# Altium project can_gateway_v3s_hardwave.PrjPcb
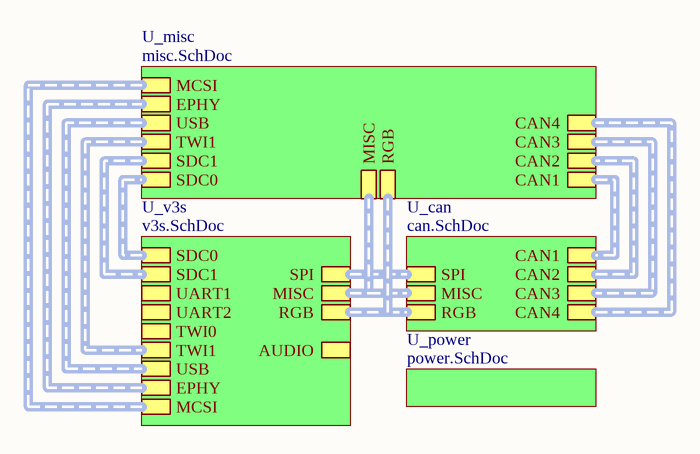
[diagram p0: can_gateway_v3s_hardwave.SchDoc]
5 sheets, 219 parts. Net scope: hierarchical (ports join the sheet entries above them; power ports are global).
Board file: can_gateway_v3s_hardwave.PcbDoc
Sheets:
  can_gateway_v3s_hardwave.SchDoc
    U_v3s = v3s.SchDoc
    U_power = power.SchDoc
    U_can = can.SchDoc
    U_misc = misc.SchDoc

## Sheet can_gateway_v3s_hardwave.SchDoc
size A4

### Sub-sheets
U_can = can.SchDoc: SPI (harness SPI), MISC (harness MISC), RGB (harness RGB), CAN4 (harness CAN), CAN3 (harness CAN), CAN2 (harness CAN), CAN1 (harness CAN)
U_misc = misc.SchDoc: SDC0 (harness SDC), CAN4 (harness CAN), CAN3 (harness CAN), CAN2 (harness CAN), CAN1 (harness CAN), EPHY (harness EPHY), USB (harness USB), MISC (harness MISC), SDC1 (harness SDC), RGB (harness RGB), MCSI (harness MCSI), TWI1 (harness TWI)
U_power = power.SchDoc: no entries
U_v3s = v3s.SchDoc: SDC0 (harness SDC), SDC1 (harness SDC), MISC (harness MISC), UART1 (harness UART), UART2 (harness UART), TWI0 (harness TWI), TWI1 (harness TWI), SPI (harness SPI), USB (harness USB), RGB (harness RGB), MCSI (harness MCSI), EPHY (harness EPHY), AUDIO (harness AUDIO)

### Buses and harness runs
harness sheet U_can/CAN1 = sheet U_misc/CAN1
harness sheet U_can/CAN2 = sheet U_misc/CAN2
harness sheet U_can/CAN3 = sheet U_misc/CAN3
harness sheet U_can/CAN4 = sheet U_misc/CAN4
harness sheet U_can/MISC = sheet U_misc/MISC = sheet U_v3s/MISC
harness sheet U_can/RGB = sheet U_misc/RGB = sheet U_v3s/RGB
harness sheet U_can/SPI = sheet U_v3s/SPI
harness sheet U_misc/EPHY = sheet U_v3s/EPHY
harness sheet U_misc/MCSI = sheet U_v3s/MCSI
harness sheet U_misc/SDC0 = sheet U_v3s/SDC0
harness sheet U_misc/SDC1 = sheet U_v3s/SDC1
harness sheet U_misc/TWI1 = sheet U_v3s/TWI1
harness sheet U_misc/USB = sheet U_v3s/USB

## Sheet v3s.SchDoc
size B
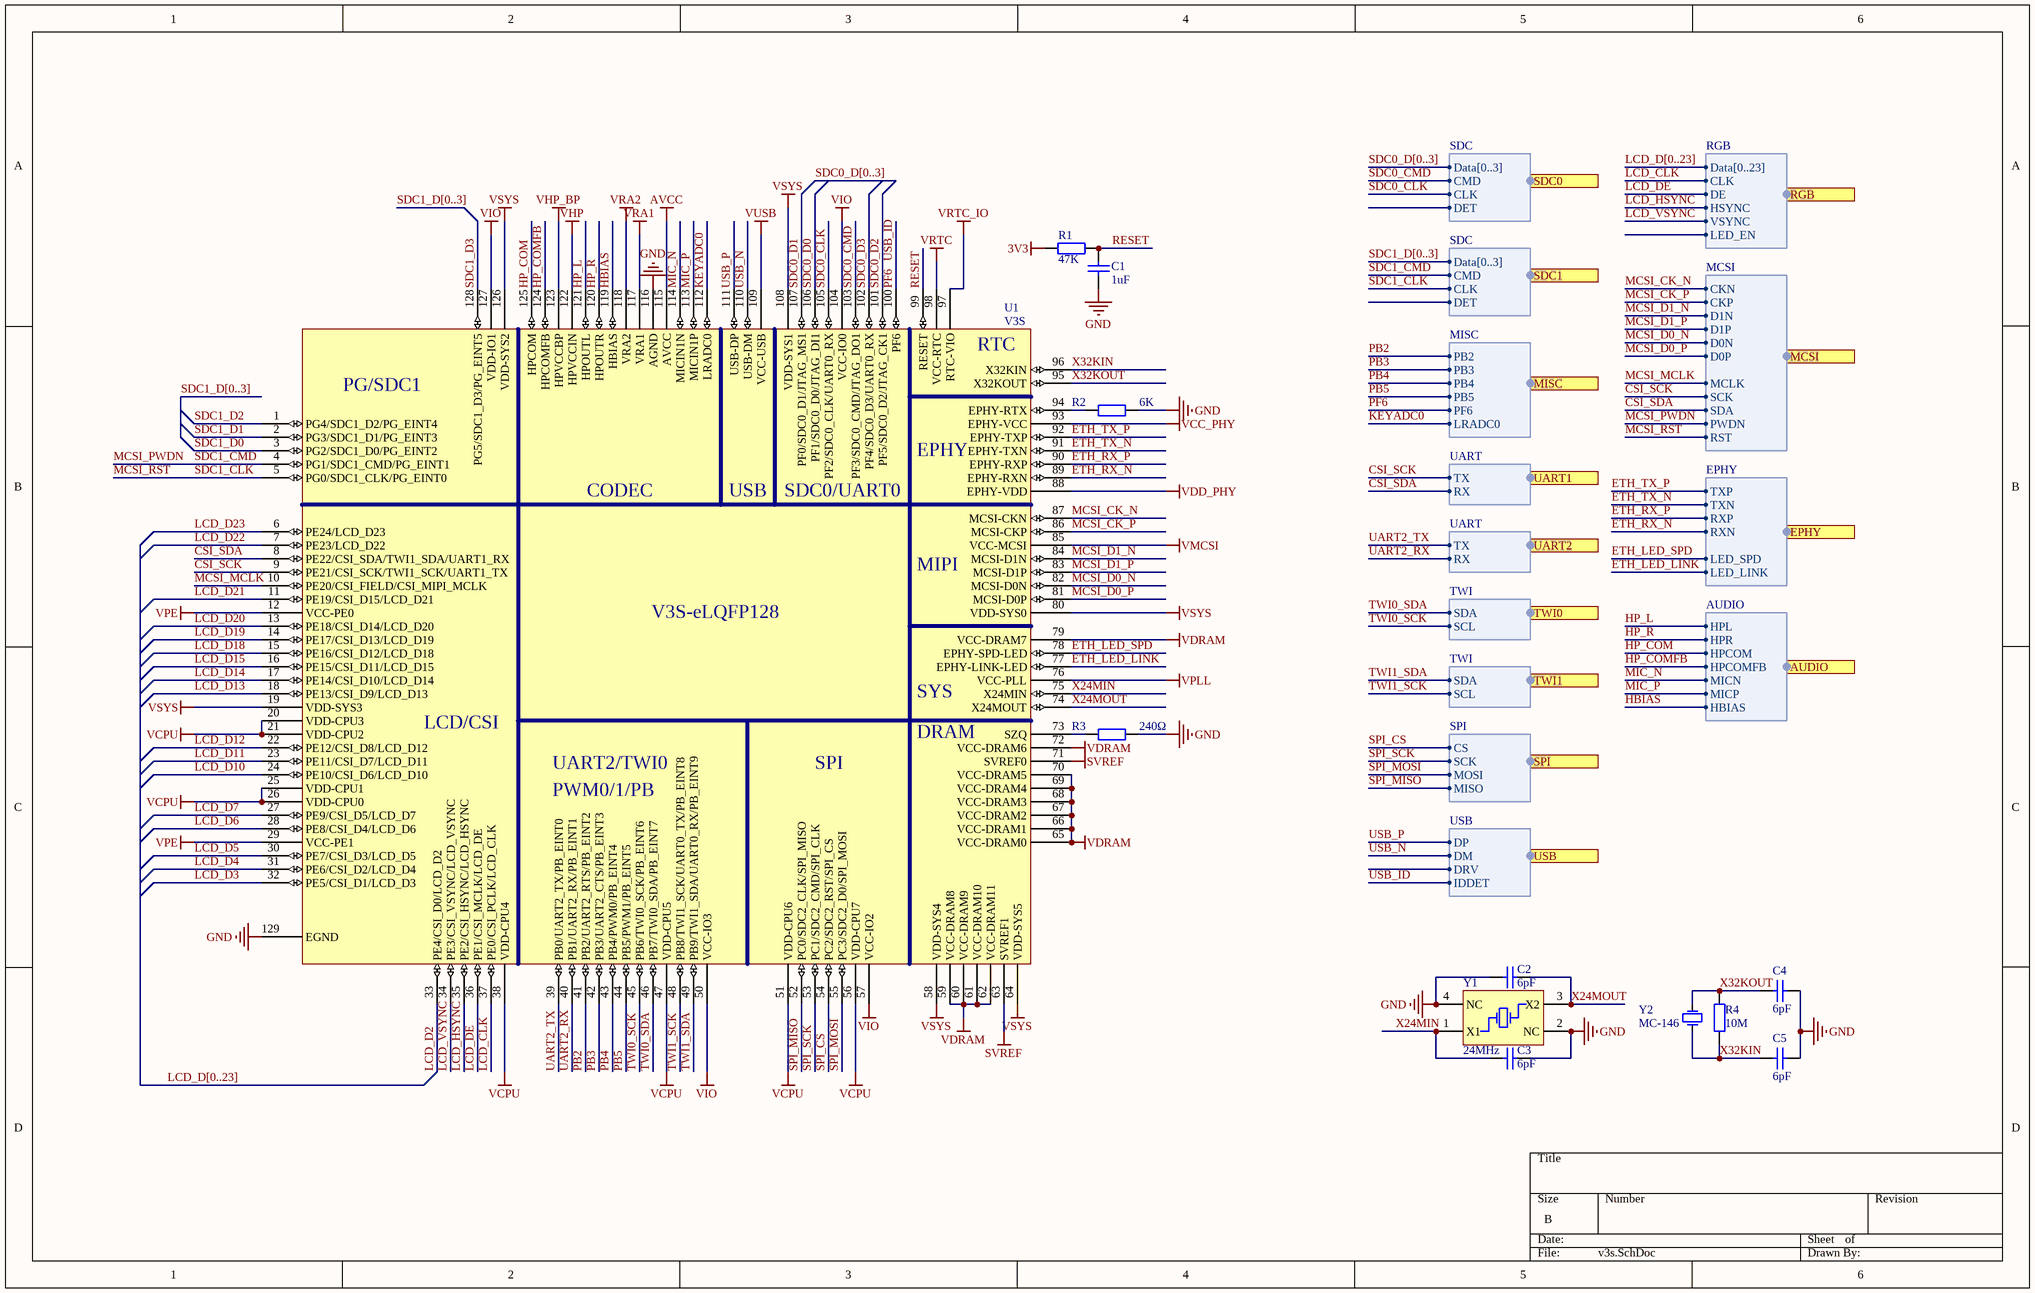
[diagram p1: v3s.SchDoc]

### Parts
C1  1uF  [CAPC1608L]
C2  6pF  [CAPC1608L]
C3  6pF  [CAPC1608L]
C4  6pF  [CAPC1608L]
C5  6pF  [CAPC1608L]
R1  47K  [RESC1608L]
R2  6K  [RESC1608L]
R3  240Ω  [RESC1608L]
R4  10M  [RESC1608L]
U1  V3S  [V3S_L]
Y1  24MHz  [XTAL-3225]
Y2  MC-146  [MC-146]

### Ports
AUDIO (harness AUDIO), EPHY (harness EPHY), MCSI (harness MCSI), MISC (harness MISC), RGB (harness RGB), SDC0 (harness SDC), SDC1 (harness SDC), SPI (harness SPI), TWI0 (harness TWI), TWI1 (harness TWI), UART1 (harness UART), UART2 (harness UART), USB (harness USB)

### Harnesses
SDC: Data[0..3], CMD, CLK, DET
UART: TX, RX
TWI: SDA, SCL
SPI: CS, SCK, MOSI, MISO
USB: DP, DM, DRV, IDDET
RGB: Data[0..23], CLK, DE, HSYNC, VSYNC, LED_EN
MCSI: CKN, CKP, D1N, D1P, D0N, D0P, MCLK, SCK, SDA, PWDN, RST
EPHY: TXP, TXN, RXP, RXN, LED_SPD, LED_LINK
AUDIO: HPL, HPR, HPCOM, HPCOMFB, MICP, HBIAS, MICN
MISC: PB2, PB3, PB4, PB5, LRADC0, PF6

### Nets
3V3: R1.1 U1.12(VCC-PE0) U1.29(VCC-PE1) U1.50(VCC-IO3) U1.57(VCC-IO2) U1.85(VCC-MCSI) U1.93(EPHY-VCC) U1.104(VCC-IO0) U1.109(VCC-USB) U1.122(HPVCCIN) U1.127(VDD-IO1)  [also labelled VCC_PHY, VHP, VIO, VMCSI, VPE, VUSB]
AVCC: U1.76(VCC-PLL) U1.115(AVCC)  [also labelled VPLL]  [project net 3V0]
GND: C1.1 C2.1 C3.2 C4.2 C5.2 R2.1 R3.1 U1.116(AGND) U1.129(EGND) Y1.2(NC) Y1.4(NC)
SVREF: U1.63(SVREF1) U1.71(SVREF0)
VCPU: U1.19(VDD-SYS3) U1.20(VDD-CPU3) U1.21(VDD-CPU2) U1.25(VDD-CPU1) U1.26(VDD-CPU0) U1.38(VDD-CPU4) U1.47(VDD-CPU5) U1.51(VDD-CPU6) U1.56(VDD-CPU7) U1.58(VDD-SYS4) U1.64(VDD-SYS5) U1.80(VDD-SYS0) U1.88(EPHY-VDD) U1.108(VDD-SYS1) U1.126(VDD-SYS2)  [also labelled VDD_PHY, VSYS]  [project net 1V2]
VDRAM: U1.59(VCC-DRAM8) U1.60(VCC-DRAM9) U1.61(VCC-DRAM10) U1.62(VCC-DRAM11) U1.65(VCC-DRAM0) U1.66(VCC-DRAM1) U1.67(VCC-DRAM2) U1.68(VCC-DRAM3) U1.69(VCC-DRAM4) U1.70(VCC-DRAM5) U1.72(VCC-DRAM6) U1.79(VCC-DRAM7)  [project net 1V8]
VHP_BP: U1.123(HPVCCBP)
VRA1: U1.117(VRA1)
VRA2: U1.118(VRA2)
VRTC: U1.98(VCC-RTC)
VRTC_IO: U1.97(RTC-VIO)
CSI_SCK: U1.9(PE21/CSI_SCK/TWI1_SCK/UART1_TX) ; port UART1.TX, port MCSI.SCK
CSI_SDA: U1.8(PE22/CSI_SDA/TWI1_SDA/UART1_RX) ; port UART1.RX, port MCSI.SDA
ETH_LED_LINK: U1.77(EPHY-LINK-LED) ; port EPHY.LED_LINK
ETH_LED_SPD: U1.78(EPHY-SPD-LED) ; port EPHY.LED_SPD
ETH_RX_N: U1.89(EPHY-RXN) ; port EPHY.RXN
ETH_RX_P: U1.90(EPHY-RXP) ; port EPHY.RXP
ETH_TX_N: U1.91(EPHY-TXN) ; port EPHY.TXN
ETH_TX_P: U1.92(EPHY-TXP) ; port EPHY.TXP
HBIAS: U1.119(HBIAS) ; port AUDIO.HBIAS
HP_COM: U1.125(HPCOM) ; port AUDIO.HPCOM
HP_COMFB: U1.124(HPCOMFB) ; port AUDIO.HPCOMFB
HP_L: U1.121(HPOUTL) ; port AUDIO.HPL
HP_R: U1.120(HPOUTR) ; port AUDIO.HPR
KEYADC0: U1.112(LRADC0) ; port MISC.LRADC0
LCD_CLK: U1.37(PE0/CSI_PCLK/LCD_CLK) ; port RGB.CLK  [project net CS2]
LCD_D2: U1.33(PE4/CSI_D0/LCD_D2)
LCD_D3: U1.32(PE5/CSI_D1/LCD_D3)
LCD_D4: U1.31(PE6/CSI_D2/LCD_D4)
LCD_D5: U1.30(PE7/CSI_D3/LCD_D5)
LCD_D6: U1.28(PE8/CSI_D4/LCD_D6)
LCD_D7: U1.27(PE9/CSI_D5/LCD_D7)
LCD_D10: U1.24(PE10/CSI_D6/LCD_D10)
LCD_D11: U1.23(PE11/CSI_D7/LCD_D11)
LCD_D12: U1.22(PE12/CSI_D8/LCD_D12)
LCD_D13: U1.18(PE13/CSI_D9/LCD_D13)
LCD_D14: U1.17(PE14/CSI_D10/LCD_D14)
LCD_D15: U1.16(PE15/CSI_D11/LCD_D15)
LCD_D18: U1.15(PE16/CSI_D12/LCD_D18)
LCD_D19: U1.14(PE17/CSI_D13/LCD_D19)
LCD_D20: U1.13(PE18/CSI_D14/LCD_D20)
LCD_D21: U1.11(PE19/CSI_D15/LCD_D21)
LCD_D22: U1.7(PE23/LCD_D22)
LCD_D23: U1.6(PE24/LCD_D23)
LCD_DE: U1.36(PE1/CSI_MCLK/LCD_DE) ; port RGB.DE  [project net CS3]
LCD_HSYNC: U1.35(PE2/CSI_HSYNC/LCD_HSYNC) ; port RGB.HSYNC  [project net CS4]
LCD_VSYNC: U1.34(PE3/CSI_VSYNC/LCD_VSYNC) ; port RGB.VSYNC
MCSI_CK_N: U1.87(MCSI-CKN) ; port MCSI.CKN
MCSI_CK_P: U1.86(MCSI-CKP) ; port MCSI.CKP
MCSI_D0_N: U1.82(MCSI-D0N) ; port MCSI.D0N
MCSI_D0_P: U1.81(MCSI-D0P) ; port MCSI.D0P
MCSI_D1_N: U1.84(MCSI-D1N) ; port MCSI.D1N
MCSI_D1_P: U1.83(MCSI-D1P) ; port MCSI.D1P
MCSI_MCLK: U1.10(PE20/CSI_FIELD/CSI_MIPI_MCLK) ; port MCSI.MCLK
MCSI_PWDN: U1.4(PG1/SDC1_CMD/PG_EINT1) ; port SDC1.CMD, port MCSI.PWDN  [also labelled SDC1_CMD]
MCSI_RST: U1.5(PG0/SDC1_CLK/PG_EINT0) ; port SDC1.CLK, port MCSI.RST  [also labelled SDC1_CLK]
MIC_N: U1.114(MICIN1N) ; port AUDIO.MICN
MIC_P: U1.113(MICIN1P) ; port AUDIO.MICP
PB2: U1.41(PB2/UART2_RTS/PB_EINT2) ; port MISC.PB2  [project net INT4]
PB3: U1.42(PB3/UART2_CTS/PB_EINT3) ; port MISC.PB3  [project net INT3]
PB4: U1.43(PB4/PWM0/PB_EINT4) ; port MISC.PB4  [project net INT2]
PB5: U1.44(PB5/PWM1/PB_EINT5) ; port MISC.PB5  [project net INT1]
PF6: U1.100(PF6) ; port USB.IDDET, port MISC.PF6  [also labelled USB_ID]
RESET: C1.2 R1.2 U1.99(RESET)
SDC0_CLK: U1.105(PF2/SDC0_CLK/UART0_RX) ; port SDC0.CLK
SDC0_CMD: U1.103(PF3/SDC0_CMD/JTAG_DO1) ; port SDC0.CMD
SDC0_D0: U1.106(PF1/SDC0_D0/JTAG_DI1)
SDC0_D1: U1.107(PF0/SDC0_D1/JTAG_MS1)
SDC0_D2: U1.101(PF5/SDC0_D2/JTAG_CK1)
SDC0_D3: U1.102(PF4/SDC0_D3/UART0_RX)
SDC1_D0: U1.3(PG2/SDC1_D0/PG_EINT2)
SDC1_D1: U1.2(PG3/SDC1_D1/PG_EINT3)
SDC1_D2: U1.1(PG4/SDC1_D2/PG_EINT4)
SDC1_D3: U1.128(PG5/SDC1_D3/PG_EINT5)
SPI_CS: U1.54(PC2/SDC2_RST/SPI_CS) ; port SPI.CS  [project net CS1]
SPI_MISO: U1.52(PC0/SDC2_CLK/SPI_MISO) ; port SPI.MISO  [project net MISO]
SPI_MOSI: U1.55(PC3/SDC2_D0/SPI_MOSI) ; port SPI.MOSI  [project net MOSI]
SPI_SCK: U1.53(PC1/SDC2_CMD/SPI_CLK) ; port SPI.SCK  [project net SCK]
TWI0_SCK: U1.45(PB6/TWI0_SCK/PB_EINT6) ; port TWI0.SCL
TWI0_SDA: U1.46(PB7/TWI0_SDA/PB_EINT7) ; port TWI0.SDA
TWI1_SCK: U1.48(PB8/TWI1_SCK/UART0_TX/PB_EINT8) ; port TWI1.SCL
TWI1_SDA: U1.49(PB9/TWI1_SDA/UART0_RX/PB_EINT9) ; port TWI1.SDA
UART2_RX: U1.40(PB1/UART2_RX/PB_EINT1) ; port UART2.RX
UART2_TX: U1.39(PB0/UART2_TX/PB_EINT0) ; port UART2.TX
USB_N: U1.110(USB-DM) ; port USB.DM  [project net DM]
USB_P: U1.111(USB-DP) ; port USB.DP  [project net DP]
X24MIN: C3.1 U1.75(X24MIN) Y1.1(X1)
X24MOUT: C2.2 U1.74(X24MOUT) Y1.3(X2)
X32KIN: C5.1 R4.1 U1.96(X32KIN) Y2.2(OSC2)
X32KOUT: C4.1 R4.2 U1.95(X32KOUT) Y2.1(OSC1)
NetR2_2: R2.2 U1.94(EPHY-RTX)
NetR3_2: R3.2 U1.73(SZQ)

### Buses and harness runs
bus LCD_D[0..23]
bus SDC0_D[0..3]
bus SDC1_D[0..3]

### Notes on the sheet
- (in symbol V3S) RTC; PG/SDC1; EPHY; CODEC; USB; SDC0/UART0; MIPI; V3S-eLQFP128; SYS; LCD/CSI; DRAM; UART2/TWI0; SPI; PWM0/1/PB

### Library data of the parts
C1-C5 = Cap1: Capacitor; Published: 8-Jun-2000; LatestRevisionDate: 17-Jul-2002; LatestRevisionNote: Re-released for DXP Platform.; PackageReference: RAD-0.3; Publisher: Altium Limited
  C1: Value: 1uF
  C2-C5: Value: 6pF
R1-R4 = Res1: Resistor; Published: 8-Jun-2000; LatestRevisionDate: 17-Jul-2002; LatestRevisionNote: Re-released for DXP Platform.; PackageReference: AXIAL-0.4; Publisher: Altium Limited
  R1: Value: 47K
  R2: Value: 6K
  R3: Value: 240Ω
  R4: Value: 10M
U1 = V3S: 全志 ARM Cortex-A7 SoC，内置64MB DDR2
Y1 = XTAL_PASSIVE_4: Crystal Oscillator; Published: 8-Jun-2000; LatestRevisionDate: 17-Jul-2002; LatestRevisionNote: Re-released for DXP Platform.; PackageReference: R38; Publisher: Altium Limited; PackageDescription: Crystal, Thru-Hole; 2 Leads; Body 3.1 x 8.2 mm (Dia.xH)
Y2 = XTAL: Crystal Oscillator; Published: 8-Jun-2000; LatestRevisionDate: 17-Jul-2002; LatestRevisionNote: Re-released for DXP Platform.; PackageReference: R38; Publisher: Altium Limited; PackageDescription: Crystal, Thru-Hole; 2 Leads; Body 3.1 x 8.2 mm (Dia.xH)

## Sheet power.SchDoc
size A4
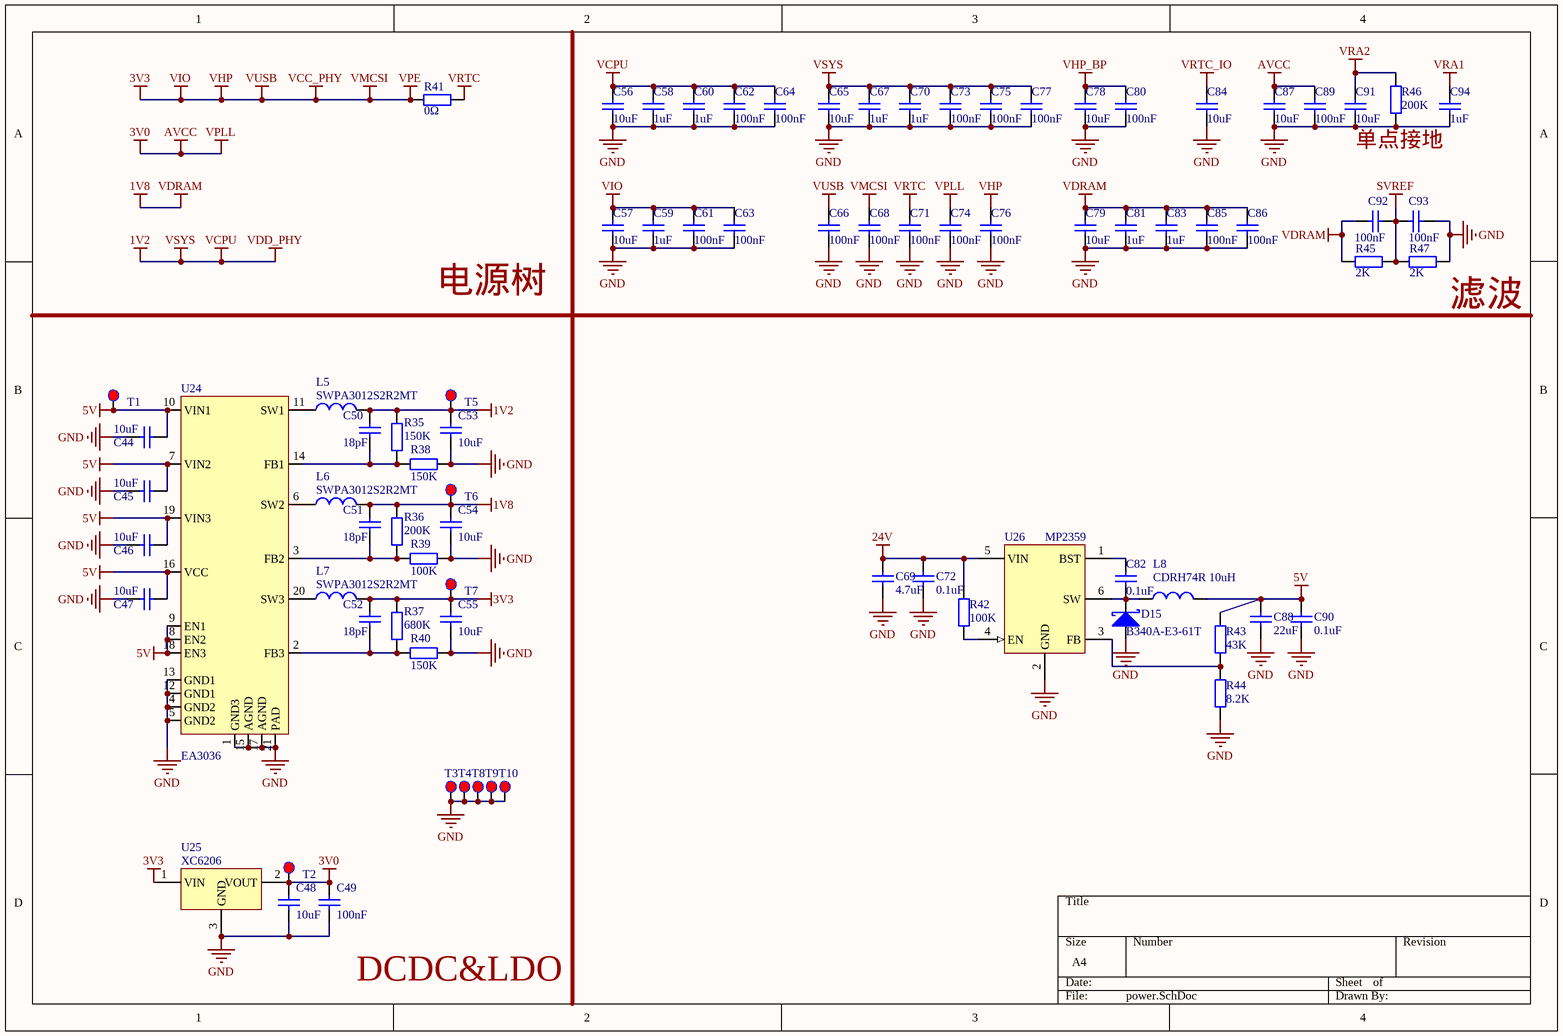
[diagram p2: power.SchDoc]

### Parts
C44  10uF  [CAPC1608L]
C45  10uF  [CAPC1608L]
C46  10uF  [CAPC1608L]
C47  10uF  [CAPC1608L]
C48  10uF  [CAPC1608L]
C49  100nF  [CAPC1608L]
C50  18pF  [CAPC1608L]
C51  18pF  [CAPC1608L]
C52  18pF  [CAPC1608L]
C53  10uF  [CAPC1608L]
C54  10uF  [CAPC1608L]
C55  10uF  [CAPC1608L]
C56  10uF  [CAPC1608L]
C57  10uF  [CAPC1608L]
C58  1uF  [CAPC1608L]
C59  1uF  [CAPC1608L]
C60  1uF  [CAPC1608L]
C61  100nF  [CAPC1608L]
C62  100nF  [CAPC1608L]
C63  100nF  [CAPC1608L]
C64  100nF  [CAPC1608L]
C65  10uF  [CAPC1608L]
C66  100nF  [CAPC1608L]
C67  1uF  [CAPC1608L]
C68  100nF  [CAPC1608L]
C69  4.7uF  [CAPC3216L]
C70  1uF  [CAPC1608L]
C71  100nF  [CAPC1608L]
C72  0.1uF  [CAPC2012L]
C73  100nF  [CAPC1608L]
C74  100nF  [CAPC1608L]
C75  100nF  [CAPC1608L]
C76  100nF  [CAPC1608L]
C77  100nF  [CAPC1608L]
C78  10uF  [CAPC1608L]
C79  10uF  [CAPC1608L]
C80  100nF  [CAPC1608L]
C81  1uF  [CAPC1608L]
C82  0.1uF  [CAPC1608L]
C83  1uF  [CAPC1608L]
C84  10uF  [CAPC1608L]
C85  100nF  [CAPC1608L]
C86  100nF  [CAPC1608L]
C87  10uF  [CAPC1608L]
C88  22uF  [CAPC3216L]
C89  100nF  [CAPC1608L]
C90  0.1uF  [CAPC2012L]
C91  10uF  [CAPC1608L]
C92  100nF  [CAPC1608L]
C93  100nF  [CAPC1608L]
C94  1uF  [CAPC1608L]
D15  B340A-E3-61T  [DO-214AC]
L5  SWPA3012S2R2MT  [IND3012_L]
L6  SWPA3012S2R2MT  [IND3012_L]
L7  SWPA3012S2R2MT  [IND3012_L]
L8  CDRH74R 10uH  [IND_7545]
R35  150K  [RESC1608L]
R36  200K  [RESC1608L]
R37  680K  [RESC1608L]
R38  150K  [RESC1608L]
R39  100K  [RESC1608L]
R40  150K  [RESC1608L]
R41  0Ω  [RESC1608L]
R42  100K  [RESC1608L]
R43  43K  [RESC1608L]
R44  8.2K  [RESC1608L]
R45  2K  [RESC1608L]
R46  200K  [RESC1608L]
R47  2K  [RESC1608L]
T1  TEST_POINT  [TEST_POINT_0.8]  (value not drawn)
T2  TEST_POINT  [TEST_POINT_0.8]  (value not drawn)
T3  TEST_POINT  [TEST_POINT_0.8]  (value not drawn)
T4  TEST_POINT  [TEST_POINT_0.8]  (value not drawn)
T5  TEST_POINT  [TEST_POINT_0.8]  (value not drawn)
T6  TEST_POINT  [TEST_POINT_0.8]  (value not drawn)
T7  TEST_POINT  [TEST_POINT_0.8]  (value not drawn)
T8  TEST_POINT  [TEST_POINT_0.8]  (value not drawn)
T9  TEST_POINT  [TEST_POINT_0.8]  (value not drawn)
T10  TEST_POINT  [TEST_POINT_0.8]  (value not drawn)
U24  EA3036  [QFN20_L]
U25  XC6206  [SOT23_L]
U26  MP2359  [SOT23-6_L]

### Nets
1V2: C50.2 C53.2 C56.2 C58.2 C60.2 C62.2 C64.2 C65.2 C67.2 C70.2 C73.2 C75.2 C77.2 L5.2 R35.2 T5.1  [also labelled VCPU, VDD_PHY, VSYS]
1V8: C51.2 C54.2 C79.2 C81.2 C83.2 C85.2 C86.2 C92.2 L6.2 R36.2 R45.1 T6.1  [also labelled VDRAM]
3V0: C48.2 C49.2 C74.2 C87.2 C89.2 T2.1 U25.2(VOUT)  [also labelled AVCC, VPLL]
3V3: C52.2 C55.2 C57.2 C59.2 C61.2 C63.2 C66.2 C68.2 C76.2 L7.2 R37.2 R41.1 T7.1 U25.1(VIN)  [also labelled VCC_PHY, VHP, VIO, VMCSI, VPE, VUSB]
5V: C44.1 C45.1 C46.1 C47.1 C88.2 C90.2 L8.2 R43.2 T1.1 U24.7(VIN2) U24.8(EN2) U24.9(EN1) U24.10(VIN1) U24.16(VCC) U24.18(EN3) U24.19(VIN3)
24V: C69.2 C72.2 R42.2 U26.5(VIN)
GND: C44.2 C45.2 C46.2 C47.2 C48.1 C49.1 C53.1 C54.1 C55.1 C56.1 C57.1 C58.1 C59.1 C60.1 C61.1 C62.1 C63.1 C64.1 C65.1 C66.1 C67.1 C68.1 C69.1 C70.1 C71.1 C72.1 C73.1 C74.1 C75.1 C76.1 C77.1 C78.1 C79.1 C80.1 C81.1 C83.1 C84.1 C85.1 C86.1 C87.1 C88.1 C89.1 C90.1 C91.1 C93.1 C94.1 D15.1(A) R38.1 R39.1 R40.1 R44.1 R46.1 R47.2 T3.1 T4.1 T8.1 T9.1 T10.1 U24.1(GND3) U24.4(GND2) U24.5(GND2) U24.12(GND1) U24.13(GND1) U24.15(AGND) U24.17(AGND) U24.21(PAD) U25.3(GND) U26.2(GND)
SVREF: C92.1 C93.2 R45.2 R47.1
VHP_BP: C78.2 C80.2
VRA1: C94.2
VRA2: C91.2 R46.2
VRTC: C71.2 R41.2
VRTC_IO: C84.2
NetC50_1: C50.1 R35.1 R38.2 U24.14(FB1)
NetC51_1: C51.1 R36.1 R39.2 U24.3(FB2)
NetC52_1: C52.1 R37.1 R40.2 U24.2(FB3)
NetC82_1: C82.1 D15.2(K) L8.1 U26.6(SW)
NetC82_2: C82.2 U26.1(BST)
NetL5_1: L5.1 U24.11(SW1)
NetL6_1: L6.1 U24.6(SW2)
NetL7_1: L7.1 U24.20(SW3)
NetR42_1: R42.1 U26.4(EN)
NetR43_1: R43.1 R44.2 U26.3(FB)

### Notes on the sheet
- 单点接地
- 电源树
- (near R47) 滤波
- (near C49) DCDC&LDO

### Library data of the parts
C44-C94 = Cap1: Capacitor; Published: 8-Jun-2000; LatestRevisionDate: 17-Jul-2002; LatestRevisionNote: Re-released for DXP Platform.; PackageReference: RAD-0.3; Publisher: Altium Limited
  C44-C48 C53-C57 C65 C78 C79 C84 C87 C91: Value: 10uF
  C49 C61-C64 C66 C68 C71 C73-C77 C80 C85 C86 C89 C92 C93: Value: 100nF
  C50-C52: Value: 18pF
  C58-C60 C67 C70 C81 C83 C94: Value: 1uF
  C69: Value: 4.7uF
  C72 C82 C90: Value: 0.1uF
  C88: Value: 22uF
D15 = D Schottky: Schottky Diode; Published: 8-Jun-2000; LatestRevisionDate: 17-Jul-2002; LatestRevisionNote: Re-released for DXP Platform.; PackageReference: SMB; Publisher: Altium Limited; Code_JEDEC: DO-214-AA
L5-L8 = Inductor: Code_IEC: 1005; Published: 8-Jun-2000; LatestRevisionDate: 29-May-2009; LatestRevisionNote: IPC-7351 Footprint Added.; PackageReference: 0402-A; Publisher: Altium Limited; PackageDescription: Chip Inductor; Code_JEITA: 0402
  L5-L7: Value: SWPA3012S2R2MT
  L8: Value: CDRH74R 10uH
R35-R47 = Res1: Resistor; Published: 8-Jun-2000; LatestRevisionDate: 17-Jul-2002; LatestRevisionNote: Re-released for DXP Platform.; PackageReference: AXIAL-0.4; Publisher: Altium Limited
  R35 R38 R40: Value: 150K
  R36 R46: Value: 200K
  R37: Value: 680K
  R39 R42: Value: 100K
  R41: Value: 0Ω
  R43: Value: 43K
  R44: Value: 8.2K
  R45 R47: Value: 2K
T1-T10 = TEST_POINT: 测试点
U25 = LDO-SOT23-3
U26 = MP2359: 1.2A, 24V, 1.4MHz异步降压转换器

## Sheet can.SchDoc
size B
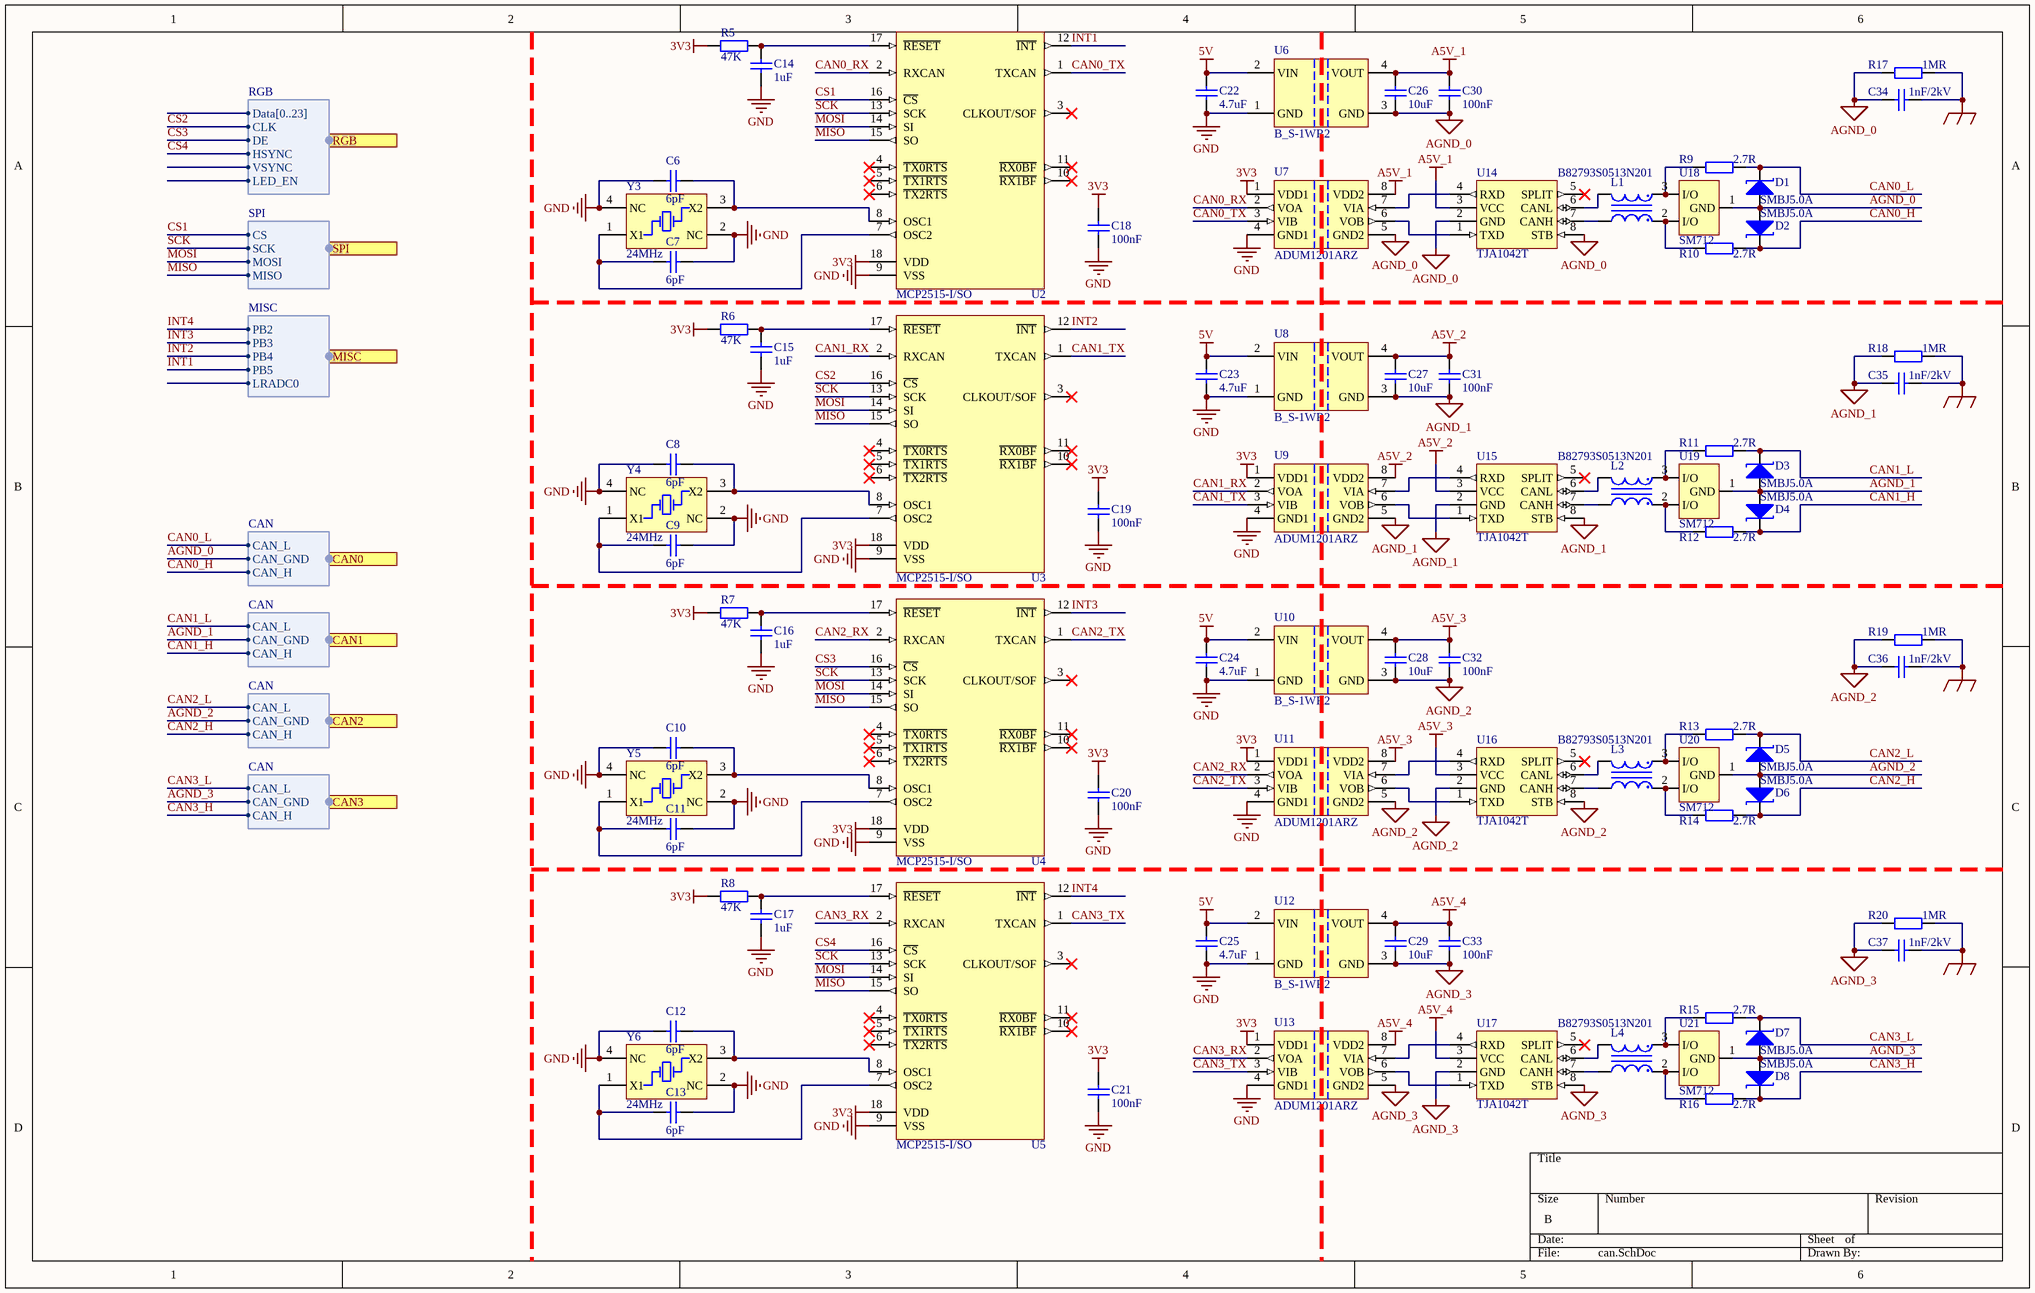
[diagram p3: can.SchDoc]

### Parts
C6  6pF  [CAPC1608L]
C7  6pF  [CAPC1608L]
C8  6pF  [CAPC1608L]
C9  6pF  [CAPC1608L]
C10  6pF  [CAPC1608L]
C11  6pF  [CAPC1608L]
C12  6pF  [CAPC1608L]
C13  6pF  [CAPC1608L]
C14  1uF  [CAPC1608L]
C15  1uF  [CAPC1608L]
C16  1uF  [CAPC1608L]
C17  1uF  [CAPC1608L]
C18  100nF  [CAPC1608L]
C19  100nF  [CAPC1608L]
C20  100nF  [CAPC1608L]
C21  100nF  [CAPC1608L]
C22  4.7uF  [CAPC2012L]
C23  4.7uF  [CAPC2012L]
C24  4.7uF  [CAPC2012L]
C25  4.7uF  [CAPC2012L]
C26  10uF  [CAPC2012L]
C27  10uF  [CAPC2012L]
C28  10uF  [CAPC2012L]
C29  10uF  [CAPC2012L]
C30  100nF  [CAPC1608L]
C31  100nF  [CAPC1608L]
C32  100nF  [CAPC1608L]
C33  100nF  [CAPC1608L]
C34  1nF/2kV  [CAPC3216L]
C35  1nF/2kV  [CAPC3216L]
C36  1nF/2kV  [CAPC3216L]
C37  1nF/2kV  [CAPC3216L]
D1  SMBJ5.0A  [DO-214AA]
D2  SMBJ5.0A  [DO-214AA]
D3  SMBJ5.0A  [DO-214AA]
D4  SMBJ5.0A  [DO-214AA]
D5  SMBJ5.0A  [DO-214AA]
D6  SMBJ5.0A  [DO-214AA]
D7  SMBJ5.0A  [DO-214AA]
D8  SMBJ5.0A  [DO-214AA]
L1  B82793S0513N201  [IND0163-B]
L2  B82793S0513N201  [IND0163-B]
L3  B82793S0513N201  [IND0163-B]
L4  B82793S0513N201  [IND0163-B]
R5  47K  [RESC1608L]
R6  47K  [RESC1608L]
R7  47K  [RESC1608L]
R8  47K  [RESC1608L]
R9  2.7R  [RESC3216L]
R10  2.7R  [RESC3216L]
R11  2.7R  [RESC3216L]
R12  2.7R  [RESC3216L]
R13  2.7R  [RESC3216L]
R14  2.7R  [RESC3216L]
R15  2.7R  [RESC3216L]
R16  2.7R  [RESC3216L]
R17  1MR  [RESC3216L]
R18  1MR  [RESC3216L]
R19  1MR  [RESC3216L]
R20  1MR  [RESC3216L]
U2  MCP2515-I/SO  [SOIC18_N]
U3  MCP2515-I/SO  [SOIC18_N]
U4  MCP2515-I/SO  [SOIC18_N]
U5  MCP2515-I/SO  [SOIC18_N]
U6  B_S-1WR2  [B_S-1WR2]
U7  ADUM1201ARZ  [SOIC8_L]
U8  B_S-1WR2  [B_S-1WR2]
U9  ADUM1201ARZ  [SOIC8_L]
U10  B_S-1WR2  [B_S-1WR2]
U11  ADUM1201ARZ  [SOIC8_L]
U12  B_S-1WR2  [B_S-1WR2]
U13  ADUM1201ARZ  [SOIC8_L]
U14  TJA1042T  [SOIC8_L]
U15  TJA1042T  [SOIC8_L]
U16  TJA1042T  [SOIC8_L]
U17  TJA1042T  [SOIC8_L]
U18  SM712  [SOT23_L]
U19  SM712  [SOT23_L]
U20  SM712  [SOT23_L]
U21  SM712  [SOT23_L]
Y3  24MHz  [XTAL-3225]
Y4  24MHz  [XTAL-3225]
Y5  24MHz  [XTAL-3225]
Y6  24MHz  [XTAL-3225]

### Ports
CAN0 (harness CAN), CAN1 (harness CAN), CAN2 (harness CAN), CAN3 (harness CAN), MISC (harness MISC), RGB (harness RGB), SPI (harness SPI)

### Harnesses
SPI: CS, SCK, MOSI, MISO
MISC: PB2, PB3, PB4, PB5, LRADC0
RGB: Data[0..23], CLK, DE, HSYNC, VSYNC, LED_EN
CAN: CAN_L, CAN_GND, CAN_H

### Nets
3V3: C18.2 C19.2 C20.2 C21.2 R5.1 R6.1 R7.1 R8.1 U2.18(VDD) U3.18(VDD) U4.18(VDD) U5.18(VDD) U7.1(VDD1) U9.1(VDD1) U11.1(VDD1) U13.1(VDD1)
5V: C22.2 C23.2 C24.2 C25.2 U6.2(VIN) U8.2(VIN) U10.2(VIN) U12.2(VIN)
A5V_1: C26.2 C30.1 U6.4(VOUT) U7.8(VDD2) U14.3(VCC)
A5V_2: C27.2 C31.1 U8.4(VOUT) U9.8(VDD2) U15.3(VCC)
A5V_3: C28.2 C32.1 U10.4(VOUT) U11.8(VDD2) U16.3(VCC)
A5V_4: C29.2 C33.1 U12.4(VOUT) U13.8(VDD2) U17.3(VCC)
AGND_0: C26.1 C30.2 C34.1 D1.1(A) D2.1(A) R17.2 U6.3(GND) U7.5(GND2) U14.2(GND) U14.8(STB) U18.1(GND) ; port CAN0.CAN_GND
AGND_1: C27.1 C31.2 C35.1 D3.1(A) D4.1(A) R18.2 U8.3(GND) U9.5(GND2) U15.2(GND) U15.8(STB) U19.1(GND) ; port CAN1.CAN_GND
AGND_2: C28.1 C32.2 C36.1 D5.1(A) D6.1(A) R19.2 U10.3(GND) U11.5(GND2) U16.2(GND) U16.8(STB) U20.1(GND) ; port CAN2.CAN_GND
AGND_3: C29.1 C33.2 C37.1 D7.1(A) D8.1(A) R20.2 U12.3(GND) U13.5(GND2) U17.2(GND) U17.8(STB) U21.1(GND) ; port CAN3.CAN_GND
EARTH: C34.2 C35.2 C36.2 C37.2 R17.1 R18.1 R19.1 R20.1
GND: C6.1 C7.2 C8.1 C9.2 C10.1 C11.2 C12.1 C13.2 C14.1 C15.1 C16.1 C17.1 C18.1 C19.1 C20.1 C21.1 C22.1 C23.1 C24.1 C25.1 U2.9(VSS) U3.9(VSS) U4.9(VSS) U5.9(VSS) U6.1(GND) U7.4(GND1) U8.1(GND) U9.4(GND1) U10.1(GND) U11.4(GND1) U12.1(GND) U13.4(GND1) Y3.2(NC) Y3.4(NC) Y4.2(NC) Y4.4(NC) Y5.2(NC) Y5.4(NC) Y6.2(NC) Y6.4(NC)
CAN0_H: D2.2(K) R10.1 ; port CAN0.CAN_H
CAN0_L: D1.2(K) R9.1 ; port CAN0.CAN_L
CAN0_RX: U2.2(RXCAN) U7.2(VOA)
CAN0_TX: U2.1(TXCAN) U7.3(VIB)
CAN1_H: D4.2(K) R12.1 ; port CAN1.CAN_H
CAN1_L: D3.2(K) R11.1 ; port CAN1.CAN_L
CAN1_RX: U3.2(RXCAN) U9.2(VOA)
CAN1_TX: U3.1(TXCAN) U9.3(VIB)
CAN2_H: D6.2(K) R14.1 ; port CAN2.CAN_H
CAN2_L: D5.2(K) R13.1 ; port CAN2.CAN_L
CAN2_RX: U4.2(RXCAN) U11.2(VOA)
CAN2_TX: U4.1(TXCAN) U11.3(VIB)
CAN3_H: D8.2(K) R16.1 ; port CAN3.CAN_H
CAN3_L: D7.2(K) R15.1 ; port CAN3.CAN_L
CAN3_RX: U5.2(RXCAN) U13.2(VOA)
CAN3_TX: U5.1(TXCAN) U13.3(VIB)
CS1: U2.16(~{CS}) ; port SPI.CS
CS2: U3.16(~{CS}) ; port RGB.CLK
CS3: U4.16(~{CS}) ; port RGB.DE
CS4: U5.16(~{CS}) ; port RGB.HSYNC
INT1: U2.12(~{INT}) ; port MISC.PB5
INT2: U3.12(~{INT}) ; port MISC.PB4
INT3: U4.12(~{INT}) ; port MISC.PB3
INT4: U5.12(~{INT}) ; port MISC.PB2
MISO: U2.15(SO) U3.15(SO) U4.15(SO) U5.15(SO) ; port SPI.MISO
MOSI: U2.14(SI) U3.14(SI) U4.14(SI) U5.14(SI) ; port SPI.MOSI
SCK: U2.13(SCK) U3.13(SCK) U4.13(SCK) U5.13(SCK) ; port SPI.SCK
NetC6_2: C6.2 U2.8(OSC1) Y3.3(X2)
NetC7_1: C7.1 U2.7(OSC2) Y3.1(X1)
NetC8_2: C8.2 U3.8(OSC1) Y4.3(X2)
NetC9_1: C9.1 U3.7(OSC2) Y4.1(X1)
NetC10_2: C10.2 U4.8(OSC1) Y5.3(X2)
NetC11_1: C11.1 U4.7(OSC2) Y5.1(X1)
NetC12_2: C12.2 U5.8(OSC1) Y6.3(X2)
NetC13_1: C13.1 U5.7(OSC2) Y6.1(X1)
NetC14_2: C14.2 R5.2 U2.17(~{RESET})
NetC15_2: C15.2 R6.2 U3.17(~{RESET})
NetC16_2: C16.2 R7.2 U4.17(~{RESET})
NetC17_2: C17.2 R8.2 U5.17(~{RESET})
NetL1_1: L1.1 R10.2 U18.2(I/O)
NetL1_2: L1.2 U14.7(CANH)
NetL1_3: L1.3 U14.6(CANL)
NetL1_4: L1.4 R9.2 U18.3(I/O)
NetL2_1: L2.1 R12.2 U19.2(I/O)
NetL2_2: L2.2 U15.7(CANH)
NetL2_3: L2.3 U15.6(CANL)
NetL2_4: L2.4 R11.2 U19.3(I/O)
NetL3_1: L3.1 R14.2 U20.2(I/O)
NetL3_2: L3.2 U16.7(CANH)
NetL3_3: L3.3 U16.6(CANL)
NetL3_4: L3.4 R13.2 U20.3(I/O)
NetL4_1: L4.1 R16.2 U21.2(I/O)
NetL4_2: L4.2 U17.7(CANH)
NetL4_3: L4.3 U17.6(CANL)
NetL4_4: L4.4 R15.2 U21.3(I/O)
NetU7_6: U7.6(VOB) U14.1(TXD)
NetU7_7: U7.7(VIA) U14.4(RXD)
NetU9_6: U9.6(VOB) U15.1(TXD)
NetU9_7: U9.7(VIA) U15.4(RXD)
NetU11_6: U11.6(VOB) U16.1(TXD)
NetU11_7: U11.7(VIA) U16.4(RXD)
NetU13_6: U13.6(VOB) U17.1(TXD)
NetU13_7: U13.7(VIA) U17.4(RXD)

Not connected (* = marked no-connect by the designer): U2 3(CLKOUT/SOF)* 4(~{TX0RTS})* 5(~{TX1RTS})* 6(~{TX2RTS})* 10(~{RX1BF})* 11(~{RX0BF})*; U3 3(CLKOUT/SOF)* 4(~{TX0RTS})* 5(~{TX1RTS})* 6(~{TX2RTS})* 10(~{RX1BF})* 11(~{RX0BF})*; U4 3(CLKOUT/SOF)* 4(~{TX0RTS})* 5(~{TX1RTS})* 6(~{TX2RTS})* 10(~{RX1BF})* 11(~{RX0BF})*; U5 3(CLKOUT/SOF)* 4(~{TX0RTS})* 5(~{TX1RTS})* 6(~{TX2RTS})* 10(~{RX1BF})* 11(~{RX0BF})*; U14 5(SPLIT)*; U15 5(SPLIT)*; U16 5(SPLIT)*; U17 5(SPLIT)*

### Library data of the parts
C6-C37 = Cap1: Capacitor; Published: 8-Jun-2000; LatestRevisionDate: 17-Jul-2002; LatestRevisionNote: Re-released for DXP Platform.; PackageReference: RAD-0.3; Publisher: Altium Limited
  C6-C13: Value: 6pF
  C14-C17: Value: 1uF
  C18-C21 C30-C33: Value: 100nF
  C22-C25: Value: 4.7uF
  C26-C29: Value: 10uF
  C34-C37: Value: 1nF/2kV
D1-D8 = Tranzorb1: Transient Voltage Suppression (TVS) Diode; Published: 24-Mar-1999; LatestRevisionDate: 17-Jul-2002; LatestRevisionNote: Re-released for DXP Platform.; PackageReference: DO-7; Publisher: Altium Limited; PackageDescription: Axial Lead Diode
L1-L4 = Inductor1: 共模电感; Code_IEC: 1005; Published: 8-Jun-2000; LatestRevisionDate: 29-May-2009; LatestRevisionNote: IPC-7351 Footprint Added.; PackageReference: 0402-A; Publisher: Altium Limited; PackageDescription: Chip Inductor; Code_JEITA: 0402; Value: B82793S0513N201
R5-R20 = Res1: Resistor; Published: 8-Jun-2000; LatestRevisionDate: 17-Jul-2002; LatestRevisionNote: Re-released for DXP Platform.; PackageReference: AXIAL-0.4; Publisher: Altium Limited
  R5-R8: Value: 47K
  R9-R16: Value: 2.7R
  R17-R20: Value: 1MR
U2-U5 = MCP2515-I/SO: Stand-Alone CAN Controller With SPI Interface, 18-Pin SOIC, Industrial Temperature; Published: 29-Jan-2009; DatasheetVersion: revE, Nov-2007; PackageVersion: revBB, Aug-2009; PackageReference: SOIC-SO18; Publisher: Altium Limited; PackageDescription: 18-Lead Plastic Small Outline (SO) - Wide 7.50mm Body [SOIC]; Supplier 1: Digi-Key; Supplier Part Number 1: MCP2515-I/SO-ND; Supplier 2: Farnell; Supplier Part Number 2: 1292239; Code_JEDEC: MS-013; ComponentLink1Description: Datasheet; ComponentLink1URL: http://ww1.microchip.com/downloads/en/DeviceDoc/21801e.pdf; ComponentLink2Description: Packaging Specification; ComponentLink2URL: http://www.microchip.com/stellent/groups/techpub_sg/documents/packagingspec/en012702.pdf; ComponentLink3Description: Microchip.com Home; ComponentLink3URL: http://www.microchip.com/
U6 U8 U10 U12 = B_S-1WR2: DC/DC 模块电源 1W，定电压输入，隔离非稳压单路输出
U7 U9 U11 U13 = ADUM1201: 双通道数字隔离器（1/1通道方向性）
U14-U17 = TJA1042T: 具有待机模式的高速CAN收发器
U18-U21 = Tranzorb2
Y3-Y6 = XTAL_PASSIVE_4: Crystal Oscillator; Published: 8-Jun-2000; LatestRevisionDate: 17-Jul-2002; LatestRevisionNote: Re-released for DXP Platform.; PackageReference: R38; Publisher: Altium Limited; PackageDescription: Crystal, Thru-Hole; 2 Leads; Body 3.1 x 8.2 mm (Dia.xH)

## Sheet misc.SchDoc
size A4
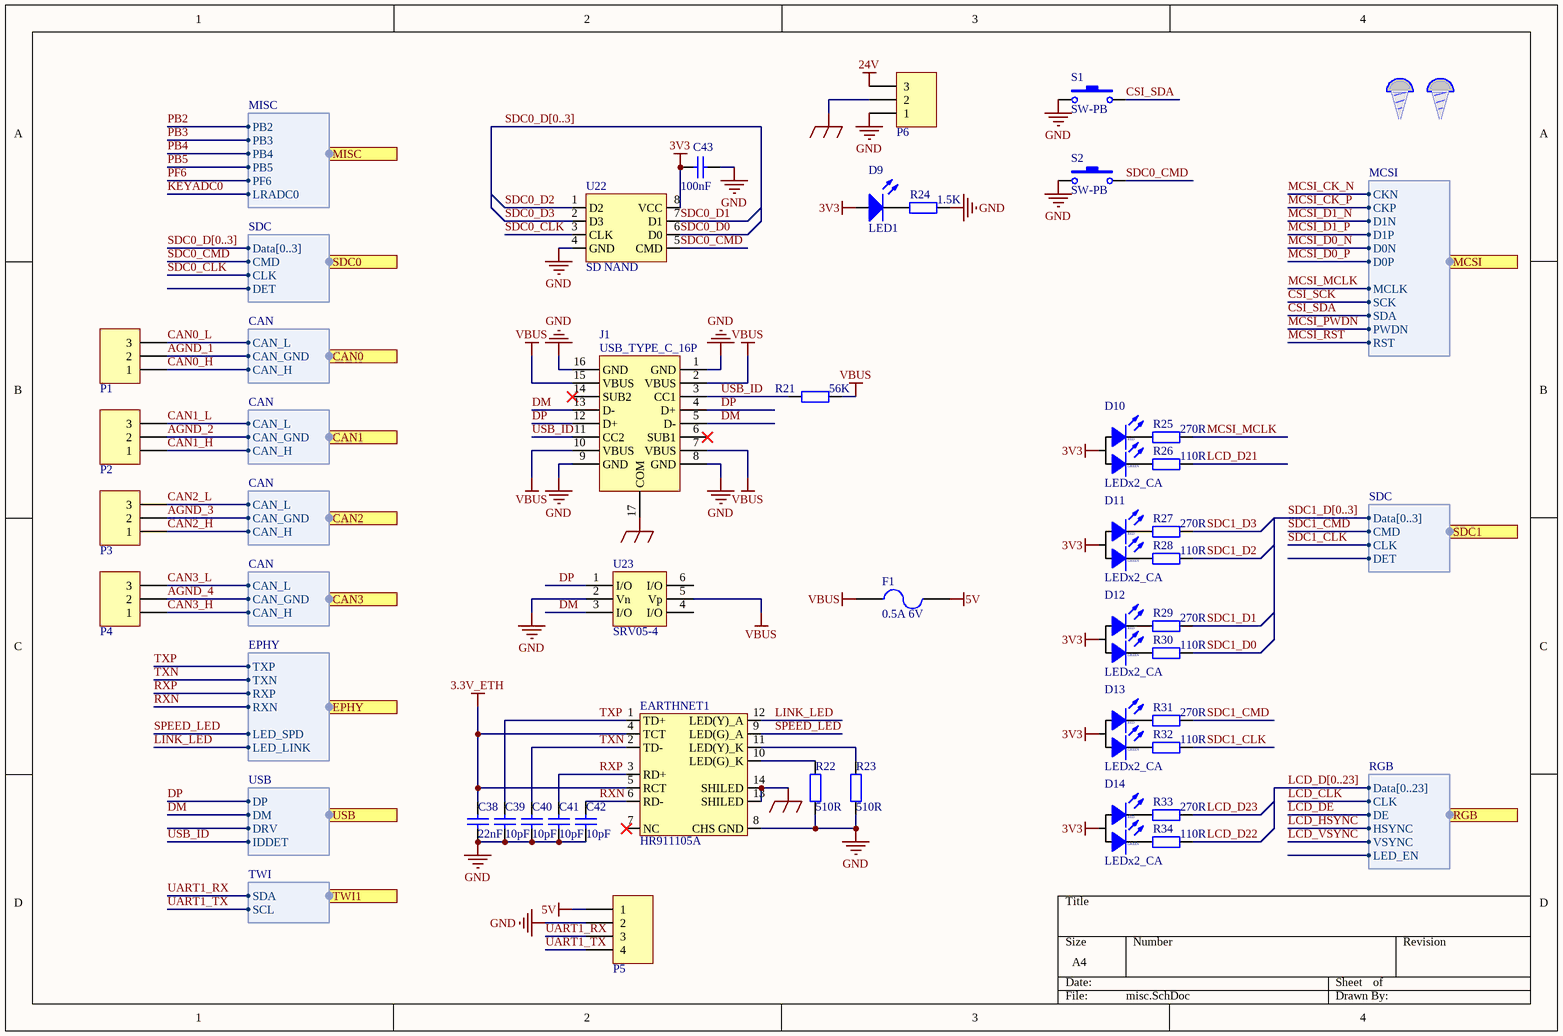
[diagram p4: misc.SchDoc]

### Parts
C38  22nF  [CAPC1608L]
C39  10pF  [CAPC1608L]
C40  10pF  [CAPC1608L]
C41  10pF  [CAPC1608L]
C42  10pF  [CAPC1608L]
C43  100nF  [CAPC1608L]
D9  LED1  [LED_3]
D10  LEDx2_CA  [LED_3x2]
D11  LEDx2_CA  [LED_3x2]
D12  LEDx2_CA  [LED_3x2]
D13  LEDx2_CA  [LED_3x2]
D14  LEDx2_CA  [LED_3x2]
EARTHNET1  HR911105A  [HR911105A]
F1  0.5A 6V  [FUSE2012L]
J1  USB_TYPE_C_16P  [USB_TYPEC_16P]
M1  M  [M3]  (value not drawn)
M2  M  [M3]  (value not drawn)
P1  Header 3  [KF2EDGR-5.08-3P_S]  (value not drawn)
P2  Header 3  [KF2EDGR-5.08-3P_S]  (value not drawn)
P3  Header 3  [KF2EDGR-5.08-3P_S]  (value not drawn)
P4  Header 3  [KF2EDGR-5.08-3P_S]  (value not drawn)
P5  Header 4  [HDR1X4]  (value not drawn)
P6  Header 3  [KF2EDGR-5.08-3P_S]  (value not drawn)
R21  56K  [RESC1005L]
R22  510R  [RESC1608L]
R23  510R  [RESC1608L]
R24  1.5K  [RESC1608L]
R25  270R  [RESC1608L]
R26  110R  [RESC1608L]
R27  270R  [RESC1608L]
R28  110R  [RESC1608L]
R29  270R  [RESC1608L]
R30  110R  [RESC1608L]
R31  270R  [RESC1608L]
R32  110R  [RESC1608L]
R33  270R  [RESC1608L]
R34  110R  [RESC1608L]
S1  SW-PB  [SW_4.5x3.8]
S2  SW-PB  [SW-3x6]
U22  SD NAND  [QFN8_L]
U23  SRV05-4  [SOT23-6_L]

### Ports
CAN0 (harness CAN), CAN1 (harness CAN), CAN2 (harness CAN), CAN3 (harness CAN), EPHY (harness EPHY), MCSI (harness MCSI), MISC (harness MISC), RGB (harness RGB), SDC0 (harness SDC), SDC1 (harness SDC), TWI1 (harness TWI), USB (harness USB)

### Harnesses
SDC: Data[0..3], CMD, CLK, DET
CAN: CAN_L, CAN_GND, CAN_H
EPHY: TXP, TXN, RXP, RXN, LED_SPD, LED_LINK
USB: DP, DM, DRV, IDDET
MISC: PB2, PB3, PB4, PB5, LRADC0, PF6
MCSI: CKN, CKP, D1N, D1P, D0N, D0P, MCLK, SCK, SDA, PWDN, RST
RGB: Data[0..23], CLK, DE, HSYNC, VSYNC, LED_EN
TWI: SDA, SCL

### Nets
3.3V_ETH: C38.2 EARTHNET1.4(TCT) EARTHNET1.5(RCT)
3V3: C43.1 D9.1(A) D10.2(A) D11.2(A) D12.2(A) D13.2(A) D14.2(A) U22.8(VCC)
5V: F1.2 P5.1
24V: P6.3
AGND_2: P2.2 ; port CAN1.CAN_GND  [project net AGND_1]
AGND_3: P3.2 ; port CAN2.CAN_GND  [project net AGND_2]
AGND_4: P4.2 ; port CAN3.CAN_GND  [project net AGND_3]
EARTH: EARTHNET1.13(SHILED) EARTHNET1.14(SHILED) J1.17(COM) P6.2
GND: C38.1 C39.1 C40.1 C41.1 C42.1 C43.2 EARTHNET1.8(CHS_GND) J1.1(GND) J1.8(GND) J1.9(GND) J1.16(GND) P5.2 P6.1 R22.1 R23.1 R24.2 S1.1 S2.1 U22.4(GND) U23.2(Vn)
VBUS: F1.1 J1.2(VBUS) J1.7(VBUS) J1.10(VBUS) J1.15(VBUS) R21.2 U23.5(Vp)
AGND_1: P1.2 ; port CAN0.CAN_GND
CAN0_H: P1.1 ; port CAN0.CAN_H
CAN0_L: P1.3 ; port CAN0.CAN_L
CAN1_H: P2.1 ; port CAN1.CAN_H
CAN1_L: P2.3 ; port CAN1.CAN_L
CAN2_H: P3.1 ; port CAN2.CAN_H
CAN2_L: P3.3 ; port CAN2.CAN_L
CAN3_H: P4.1 ; port CAN3.CAN_H
CAN3_L: P4.3 ; port CAN3.CAN_L
CSI_SDA: S1.2 ; port MCSI.SDA
DM: J1.5(D-) J1.13(D-) U23.3(I/O) ; port USB.DM
DP: J1.4(D+) J1.12(D+) U23.1(I/O) ; port USB.DP
LCD_D21: R26.2
LCD_D22: R34.2
LCD_D23: R33.2
LINK_LED: EARTHNET1.12(LED(Y)_A) ; port EPHY.LED_LINK  [project net ETH_LED_LINK]
MCSI_MCLK: R25.2 ; port MCSI.MCLK
MCSI_PWDN: R31.2 ; port SDC1.CMD, port MCSI.PWDN  [also labelled SDC1_CMD]
MCSI_RST: R32.2 ; port SDC1.CLK, port MCSI.RST  [also labelled SDC1_CLK]
PF6: J1.3(CC1) J1.11(CC2) R21.1 ; port USB.IDDET, port MISC.PF6  [also labelled USB_ID]
RXN: C42.2 EARTHNET1.6(RD-) ; port EPHY.RXN  [project net ETH_RX_N]
RXP: C41.2 EARTHNET1.3(RD+) ; port EPHY.RXP  [project net ETH_RX_P]
SDC0_CLK: U22.3(CLK) ; port SDC0.CLK
SDC0_CMD: S2.2 U22.5(CMD) ; port SDC0.CMD
SDC0_D0: U22.6(D0)
SDC0_D1: U22.7(D1)
SDC0_D2: U22.1(D2)
SDC0_D3: U22.2(D3)
SDC1_D0: R30.2
SDC1_D1: R29.2
SDC1_D2: R28.2
SDC1_D3: R27.2
SPEED_LED: EARTHNET1.9(LED(G)_A) ; port EPHY.LED_SPD  [project net ETH_LED_SPD]
TXN: C40.2 EARTHNET1.2(TD-) ; port EPHY.TXN  [project net ETH_TX_N]
TXP: C39.2 EARTHNET1.1(TD+) ; port EPHY.TXP  [project net ETH_TX_P]
UART1_RX: P5.3 ; port TWI1.SDA  [project net TWI1_SDA]
UART1_TX: P5.4 ; port TWI1.SCL  [project net TWI1_SCK]
NetD9_2: D9.2(K) R24.1
NetD10_1: D10.1(K) R26.1
NetD10_3: D10.3(K) R25.1
NetD11_1: D11.1(K) R28.1
NetD11_3: D11.3(K) R27.1
NetD12_1: D12.1(K) R30.1
NetD12_3: D12.3(K) R29.1
NetD13_1: D13.1(K) R32.1
NetD13_3: D13.3(K) R31.1
NetD14_1: D14.1(K) R34.1
NetD14_3: D14.3(K) R33.1
NetEARTHNET1_10: EARTHNET1.10(LED(G)_K) R22.2
NetEARTHNET1_11: EARTHNET1.11(LED(Y)_K) R23.2

Not connected (* = marked no-connect by the designer): EARTHNET1 7(NC)*; J1 6(SUB1)* 14(SUB2)*; U23 4(I/O) 6(I/O)

### Buses and harness runs
bus LCD_D[0..23]
bus SDC0_D[0..3]
bus SDC1_D[0..3]

### Notes on the sheet
- (in symbol LEDx2_CA) RED; GREEN

### Library data of the parts
C38-C43 = Cap1: Capacitor; Published: 8-Jun-2000; LatestRevisionDate: 17-Jul-2002; LatestRevisionNote: Re-released for DXP Platform.; PackageReference: RAD-0.3; Publisher: Altium Limited
  C38: Value: 22nF
  C39-C42: Value: 10pF
  C43: Value: 100nF
D9 = LED1: Typical RED GaAs LED; Published: 8-Jun-2000; LatestRevisionDate: 08-Jul-2005; LatestRevisionNote: Mech Layer 1 removed.; PackageReference: LED-1; Publisher: Altium Limited; PackageDescription: LED; 2 Leads
D10-D14 = LEDx2_CA: 共阳红绿双色二极管; Published: 8-Jun-2000; LatestRevisionDate: 08-Jul-2005; LatestRevisionNote: Mech Layer 1 removed.; PackageReference: LED-1; Publisher: Altium Limited; PackageDescription: LED; 2 Leads
F1 = Fuse 2: Fuse; Published: 8-Jun-2000; LatestRevisionDate: 17-Jul-2002; LatestRevisionNote: Re-released for DXP Platform.; PackageReference: PIN-W2/E2.8; Publisher: Altium Limited; PackageDescription: Thru-Hole; 2 Leads
P1-P4 P6 = Header 3: Header, 3-Pin; LatestRevisionDate: 17-Jul-2002; LatestRevisionNote: Re-released for DXP Platform.; Publisher: Altium Limited
P5 = Header 4: Header, 4-Pin; LatestRevisionDate: 17-Jul-2002; LatestRevisionNote: Re-released for DXP Platform.; Publisher: Altium Limited
R21-R34 = Res1: Resistor; Published: 8-Jun-2000; LatestRevisionDate: 17-Jul-2002; LatestRevisionNote: Re-released for DXP Platform.; PackageReference: AXIAL-0.4; Publisher: Altium Limited
  R21: Value: 56K
  R22 R23: Value: 510R
  R24: Value: 1.5K
  R25 R27 R29 R31 R33: Value: 270R
  R26 R28 R30 R32 R34: Value: 110R
S1 S2 = SW-PB: Switch; Published: 24-Mar-1999; LatestRevisionDate: 17-Jul-2002; LatestRevisionNote: Re-released for DXP Platform.; PackageReference: SPST-2; Publisher: Altium Limited; PackageDescription: Switch; 2 Leads
U22 = SD NAND: 贴片式SD卡
U23 = NUP4201

## Nets that join several sheets
1V2: v3s (15 pins), power (16 pins)
1V8: v3s (12 pins), power (12 pins)
3V0: v3s (U1.76 U1.115), power (7 pins)
3V3: v3s (11 pins), power (14 pins), can (16 pins), misc (8 pins)
5V: power (16 pins), can (8 pins), misc (F1.2 P5.1)
24V: power (C69.2 C72.2 R42.2 U26.5), misc (P6.3)
AGND_1: can (11 pins), misc (P2.2)
AGND_2: can (11 pins), misc (P3.2)
AGND_3: can (11 pins), misc (P4.2)
EARTH: can (8 pins), misc (EARTHNET1.13 EARTHNET1.14 J1.17 P6.2)
GND: v3s (11 pins), power (68 pins), can (40 pins), misc (20 pins)
SVREF: v3s (U1.63 U1.71), power (C92.1 C93.2 R45.2 R47.1)
VHP_BP: v3s (U1.123), power (C78.2 C80.2)
VRA1: v3s (U1.117), power (C94.2)
VRA2: v3s (U1.118), power (C91.2 R46.2)
VRTC: v3s (U1.98), power (C71.2 R41.2)
VRTC_IO: v3s (U1.97), power (C84.2)
CAN1_H: can (D4.2 R12.1), misc (P2.1)
CAN1_L: can (D3.2 R11.1), misc (P2.3)
CAN2_H: can (D6.2 R14.1), misc (P3.1)
CAN2_L: can (D5.2 R13.1), misc (P3.3)
CAN3_H: can (D8.2 R16.1), misc (P4.1)
CAN3_L: can (D7.2 R15.1), misc (P4.3)
CS1: v3s (U1.54), can (U2.16)
CS2: v3s (U1.37), can (U3.16)
CS3: v3s (U1.36), can (U4.16)
CS4: v3s (U1.35), can (U5.16)
CSI_SDA: v3s (U1.8), misc (S1.2)
DM: v3s (U1.110), misc (J1.5 J1.13 U23.3)
DP: v3s (U1.111), misc (J1.4 J1.12 U23.1)
ETH_LED_LINK: v3s (U1.77), misc (EARTHNET1.12)
ETH_LED_SPD: v3s (U1.78), misc (EARTHNET1.9)
ETH_RX_N: v3s (U1.89), misc (C42.2 EARTHNET1.6)
ETH_RX_P: v3s (U1.90), misc (C41.2 EARTHNET1.3)
ETH_TX_N: v3s (U1.91), misc (C40.2 EARTHNET1.2)
ETH_TX_P: v3s (U1.92), misc (C39.2 EARTHNET1.1)
INT1: v3s (U1.44), can (U2.12)
INT2: v3s (U1.43), can (U3.12)
INT3: v3s (U1.42), can (U4.12)
INT4: v3s (U1.41), can (U5.12)
LCD_D21: v3s (U1.11), misc (R26.2)
LCD_D22: v3s (U1.7), misc (R34.2)
LCD_D23: v3s (U1.6), misc (R33.2)
MCSI_MCLK: v3s (U1.10), misc (R25.2)
MCSI_PWDN: v3s (U1.4), misc (R31.2)
MCSI_RST: v3s (U1.5), misc (R32.2)
MISO: v3s (U1.52), can (U2.15 U3.15 U4.15 U5.15)
MOSI: v3s (U1.55), can (U2.14 U3.14 U4.14 U5.14)
PF6: v3s (U1.100), misc (J1.3 J1.11 R21.1)
SCK: v3s (U1.53), can (U2.13 U3.13 U4.13 U5.13)
SDC0_CLK: v3s (U1.105), misc (U22.3)
SDC0_CMD: v3s (U1.103), misc (S2.2 U22.5)
SDC0_D0: v3s (U1.106), misc (U22.6)
SDC0_D1: v3s (U1.107), misc (U22.7)
SDC0_D2: v3s (U1.101), misc (U22.1)
SDC0_D3: v3s (U1.102), misc (U22.2)
TWI1_SCK: v3s (U1.48), misc (P5.4)
TWI1_SDA: v3s (U1.49), misc (P5.3)